# EasyEDA Pro project final.epro

# Schematic Schematic1
Board Name: Board1; Create Date: 2025-11-11; Page Name: P1; Project Name: New Project_2025-11-10_18-30-36; Schematic Name: Schematic1; Update Date: 2025-11-22; Company: EasyEDA.com; Page Size: A4; Version: V1.0
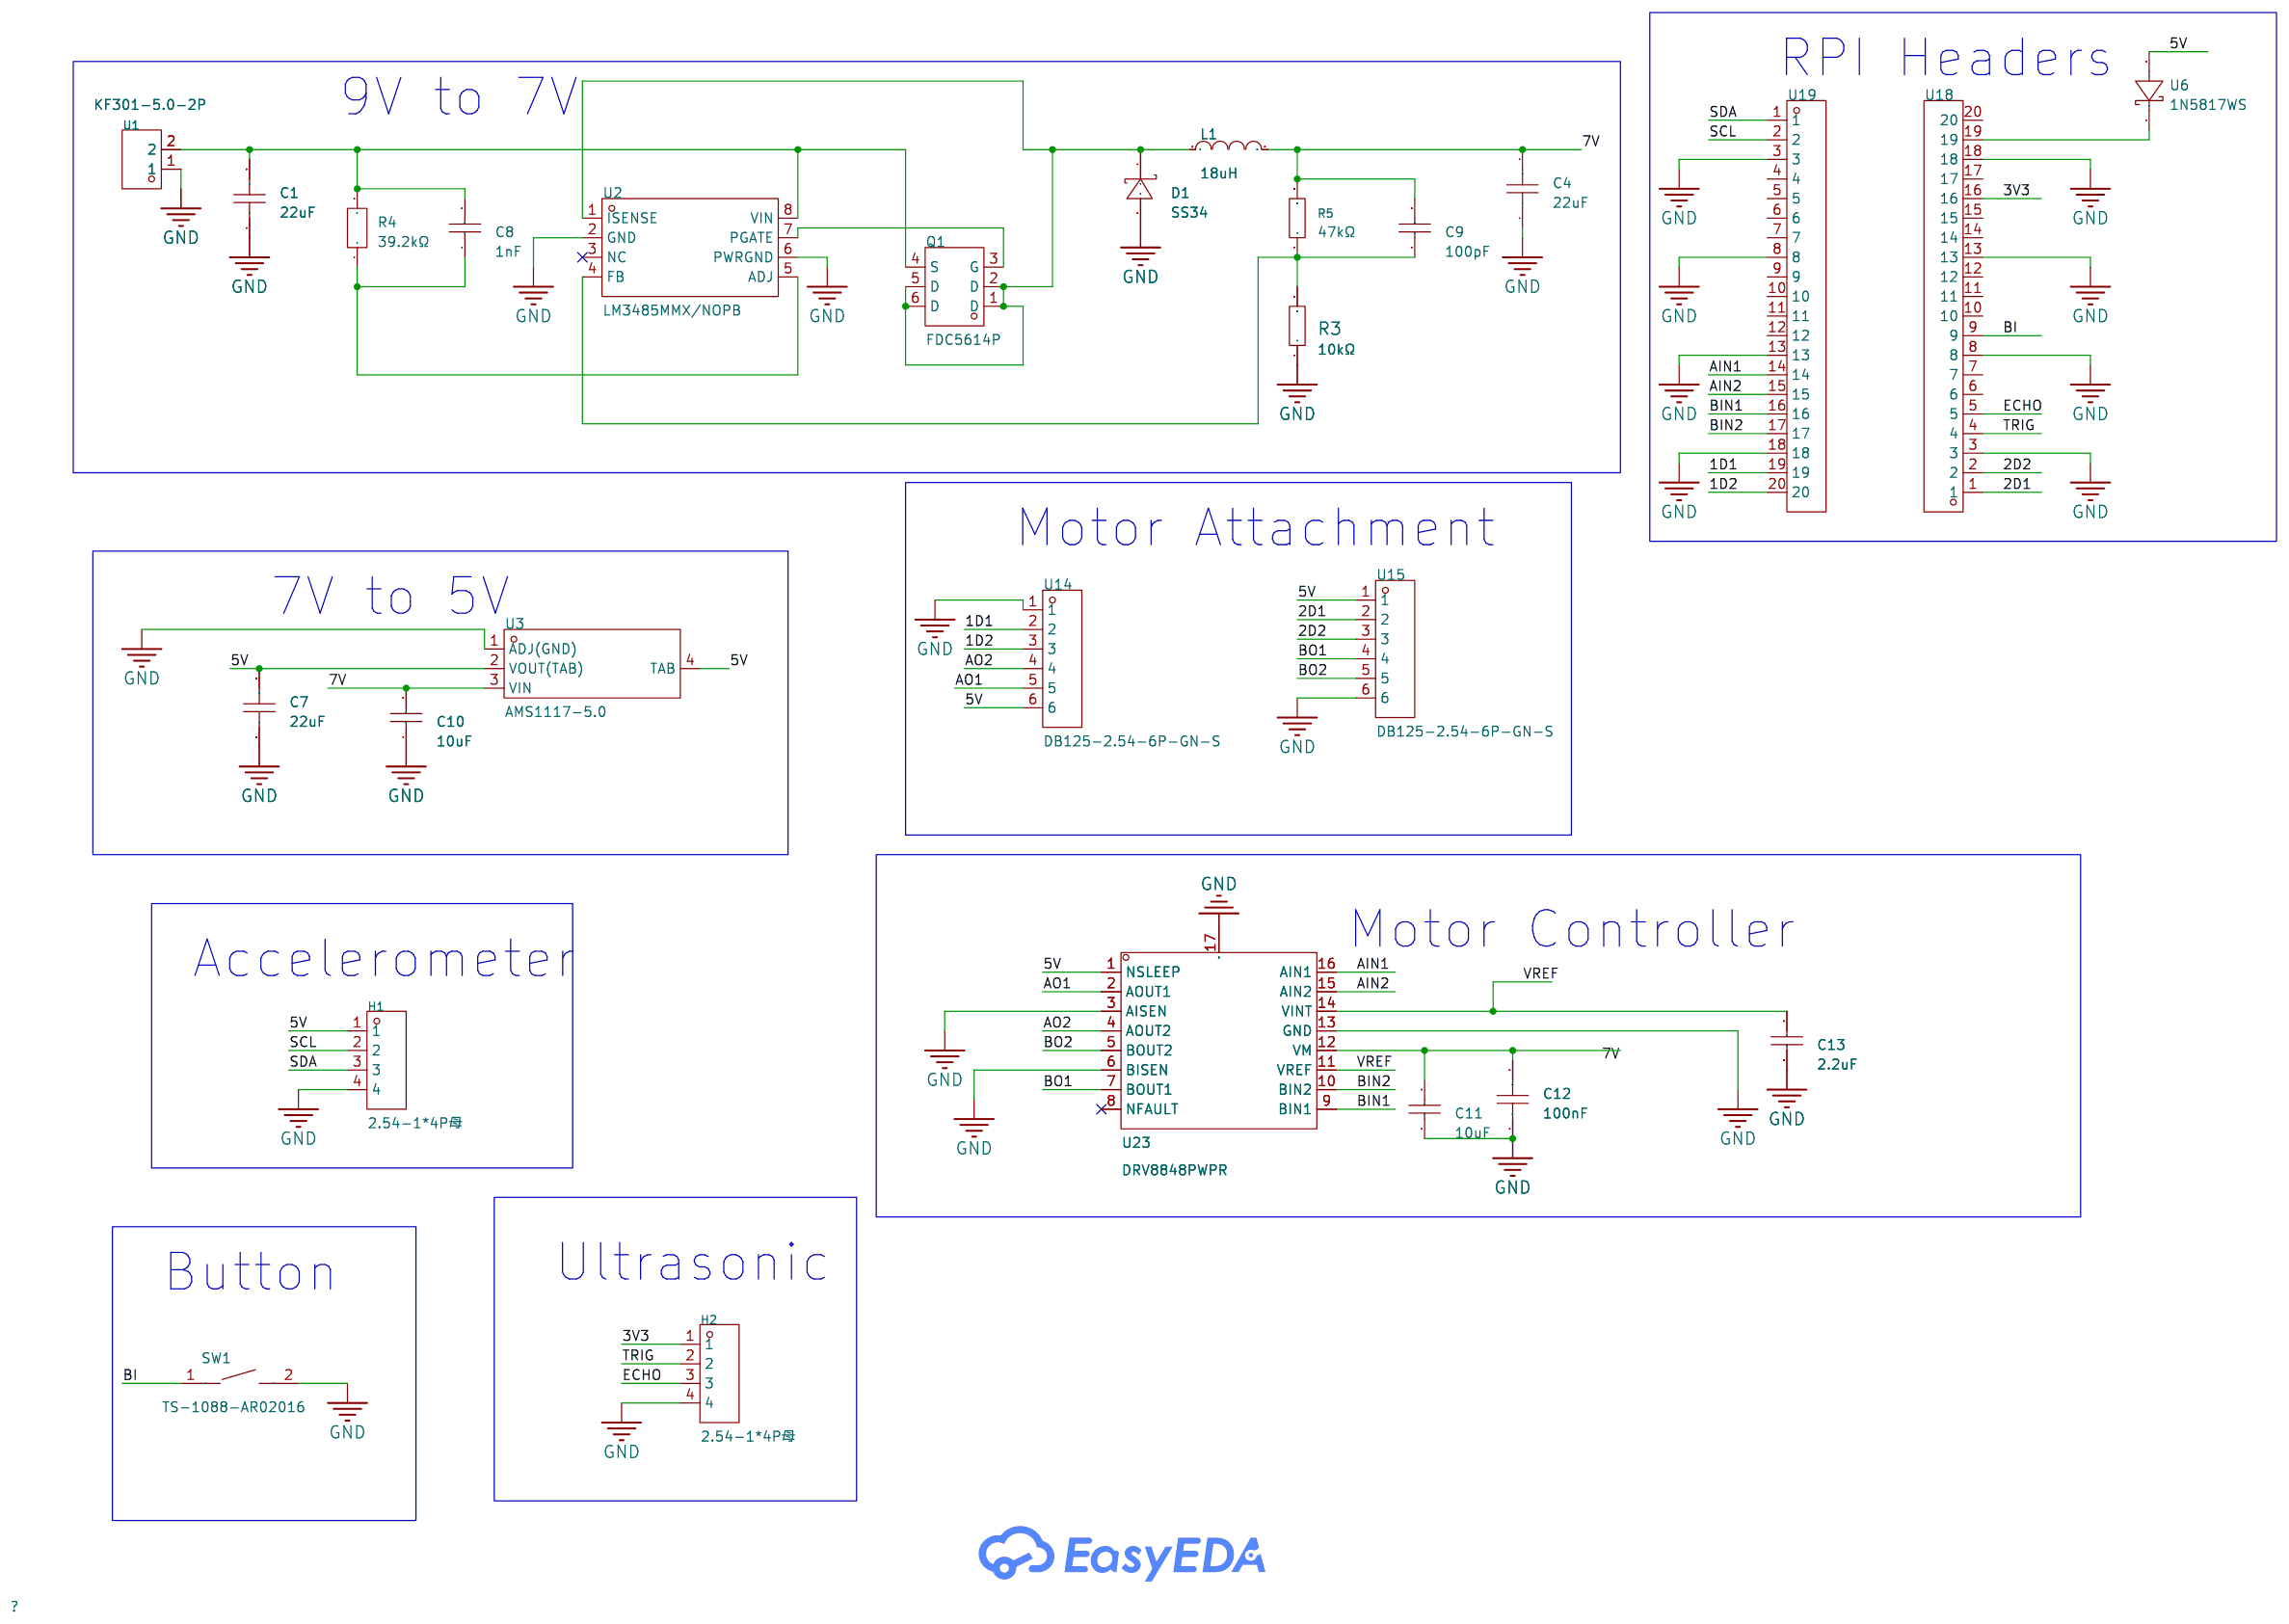
[diagram p0: schematic sheet]

## Parts
C1  22uF  [C0603]
C4  22uF  [C0603]
C7  22uF  [C0603]
C8  1nF  [C0402]
C9  100pF  [C0402]
C10  10uF  [C1206]
C11  10uF  [C1206]
C12  100nF  [C0402]
C13  2.2uF  [C0603]
D1  SS34  [SMA_L4.3-W2.6-LS5.2-RD]
H1  2.54-1*4P母  [HDR-TH_4P-P2.54-V-F]
H2  2.54-1*4P母  [HDR-TH_4P-P2.54-V-F]
L1  18uH  [IND-SMD_L4.0-W4.0_FNR4012S]
Q1  FDC5614P  [SOT-23-6_L2.9-W1.6-P0.95-LS2.8-BR]
R3  10kΩ  [R0603]
R4  39.2kΩ  [R0402]
R5  47kΩ  [R0805]
SW1  TS-1088-AR02016  [SW-SMD_L3.9-W3.0-P4.45]
U1  KF301-5.0-2P  [CONN-TH_P5.00_KF301-5.0-2P]
U2  LM3485MMX/NOPB  [VSSOP-8_L3.0-W3.0-P0.65-LS4.9-BL]
U3  AMS1117-5.0  [SOT-223_L6.7-W3.5-P2.30-BR]
U6  1N5817WS  [SOD-323_L1.7-W1.3-LS2.6-RD-1]
U14  DB125-2.54-6P-GN-S  [CONN-TH_DB125-2.54-6P-GN]
U15  DB125-2.54-6P-GN-S  [CONN-TH_DB125-2.54-6P-GN]
U18  ZX-PM2.54-1-20PY  [HDR-TH_20P-P2.54-V-F]
U19  ZX-PM2.54-1-20PY  [HDR-TH_20P-P2.54-V-F]
U23  DRV8848PWPR  [HTSSOP-16_L5.0-W4.4-P0.65-LS6.4-BL-EP]

## Library data of the parts
C1 C4 C7 = CL10A226MQ8NRNC: Capacitance:22uF Tolerance:±20% Tolerance:±20% Voltage Rating:6.3V Temperature Coefficient:X5R; LCSC Part Name: 22uF ±20% 6.3V; Supplier Part: C59461; Manufacturer: SAMSUNG(三星); Supplier Footprint: 0603; JLCPCB Part Class: Basic Part; Datasheet: https://item.szlcsc.com/datasheet/CL10A226MQ8NRNC/60514.html; Supplier: LCSC; Tolerance: ±20%; Voltage Rating: 6.3V; Temperature Coefficient: X5R
C8 = 0402B102K500NT: Capacitance:1nF Tolerance:±10% Tolerance:±10% Voltage Rating:50V Temperature Coefficient:X7R; LCSC Part Name: 1nF ±10% 50V; Supplier Part: C1523; Manufacturer: FH(风华); Supplier Footprint: 0402; JLCPCB Part Class: Basic Part; Datasheet: https://item.szlcsc.com/datasheet/0402B102K500NT/1875.html; Supplier: LCSC; Tolerance: ±10%; Voltage Rating: 50V; Temperature Coefficient: X7R
C9 = 0402CG101J500NT: Capacitance: Tolerance:±5% Tolerance:±5% Voltage Rated: Temperature Coefficient:; LCSC Part Name: 100pF ±5% 50V; Supplier Part: C1546; Manufacturer: FH(风华); Supplier Footprint: 0402; JLCPCB Part Class: Basic Part; Datasheet: https://atta.szlcsc.com/upload/public/pdf/source/20200305/C486355_26A10D38EF8C2A5C37091D0039909270.pdf; Supplier: LCSC; Tolerance: ±5%
C10 C11 = CL31A106KBHNNNE: Capacitance:10uF Tolerance:±10% Tolerance:±10% Voltage Rating:50V Temperature Coefficient:X5R; LCSC Part Name: 10uF ±10% 50V; Supplier Part: C13585; Manufacturer: SAMSUNG(三星); Supplier Footprint: 1206; JLCPCB Part Class: Basic Part; Datasheet: https://item.szlcsc.com/datasheet/CL31A106KBHNNNE/14236.html; Supplier: LCSC; Tolerance: ±10%; Voltage Rating: 50V; Temperature Coefficient: X5R
C12 = CL05B104KO5NNNC: Capacitance:100nF Tolerance:±10% Tolerance:±10% Voltage Rating:16V Temperature Coefficient:X7R; LCSC Part Name: 100nF ±10% 16V; Supplier Part: C1525; Manufacturer: SAMSUNG(三星); Supplier Footprint: 0402; JLCPCB Part Class: Basic Part; Datasheet: https://item.szlcsc.com/datasheet/CL05B104KO5NNNC/1877.html; Supplier: LCSC; Tolerance: ±10%; Voltage Rating: 16V; Temperature Coefficient: X7R
C13 = CL10A225KO8NNNC: Capacitance:2.2uF Tolerance:±10% Tolerance:±10% Voltage Rating:16V Temperature Coefficient:X5R; LCSC Part Name: 2.2uF ±10% 16V; Supplier Part: C23630; Manufacturer: SAMSUNG(三星); Supplier Footprint: 0603; JLCPCB Part Class: Basic Part; Datasheet: https://item.szlcsc.com/datasheet/CL10A225KO8NNNC/24366.html; Supplier: LCSC; Tolerance: ±10%; Voltage Rating: 16V; Temperature Coefficient: X5R
D1 = SS34_C8678: Diode Configuration:Independent Voltage - Forward(Vf@If):550mV@3A Voltage - DC Reverse(Vr):40V Current - Rectified:3A Reverse Leakage Current (Ir):500uA@40V Operating Junction Temperature Range:-55℃~+125℃ Operating Junction Temperature Range:-55℃~+125℃; LCSC Part Name: 电压:40V 电流:3A; Supplier Part: C8678; Manufacturer: MDD(辰达半导体); Supplier Footprint: SMA(DO-214AC); JLCPCB Part Class: Basic Part; Datasheet: https://item.szlcsc.com/datasheet/SS34/9178.html; Supplier: LCSC; Diode Configuration: Independent; Voltage - Forward(Vf@If): 550mV@3A; Voltage - DC Reverse(Vr): 40V; Current - Rectified: 3A; Reverse Leakage Current (Ir): 500uA@40V; Operating Junction Temperature Range: -55℃~+125℃
H1 H2 = 2.54-1*4P母: Holes Structure:1x4P Pitch:2.54mm Row Spacing:- Circular Hole / Square Hole:Square Hole Mounting Type:Through Hole Number of Rows:1 Number of Positions:4P Current Rating:3A Voltage Rating (Max):- Holes Direction:Top Insulation Height:- Contact Material:Br; LCSC Part Name: 间距:2.54mm 1x4P 直插; Supplier Part: C2718488; Manufacturer: BOOMELE(博穆精密); Supplier Footprint: 插件,P=2.54mm; JLCPCB Part Class: Extended Part; Datasheet: https://item.szlcsc.com/datasheet/2.54-1*4P%25E6%25AF%258D/2834502.html; Supplier: LCSC; Holes Structure: 1x4P; Pitch: 2.54mm; Circular Hole / Square Hole: Square Hole; Mounting Type: Through Hole; Number of Rows: 1; Number of Positions: 4P; Current Rating: 3A; Holes Direction: Top; Contact Material: Bronze; Operating Temperature: -40℃~+105℃
L1 = FNR4012S180MT: Inductance:18uH Tolerance:±20% Tolerance:±20% Current Rating:800mA Current - Saturation(Isat):750mA DC Resistance(DCR):611mΩ Type:Magnetic Shielded Inductor; LCSC Part Name: 18uH ±20% 750mA; Supplier Part: C167788; Manufacturer: cjiang(长江微电); Supplier Footprint: SMD,4x4mm; JLCPCB Part Class: Extended Part; Datasheet: https://item.szlcsc.com/datasheet/FNR4012S180MT/179171.html; Supplier: LCSC; Tolerance: ±20%; Current Rating: 800mA; Current - Saturation(Isat): 750mA; DC Resistance(DCR): 611mΩ; Type: Magnetic Shielded Inductor
Q1 = FDC5614P_C3029022: Number:1 P-Channel Drain to Source Voltage:60V Current - Continuous Drain(Id):3.3A RDS(on):80mΩ@10V Pd - Power Dissipation:2W Gate Threshold Voltage (Vgs(th)):1.6V@250uA Gate Charge(Qg):10nC@10V Input Capacitance(Ciss):720pF Reverse Transfer Capacitance (; LCSC Part Name: FDC5614P丝印564 1个P沟道 耐压:60V 电流:3.3A; Supplier Part: C3029022; Manufacturer: MSKSEMI(美森科); Supplier Footprint: SOT-23-6; JLCPCB Part Class: Extended Part; Datasheet: https://item.szlcsc.com/datasheet/FDC5614P/3559745.html; Supplier: LCSC; Number: 1 P-Channel; Drain to Source Voltage: 60V; Current - Continuous Drain(Id): 3.3A; RDS(on): 80mΩ@10V; Pd - Power Dissipation: 2W; Gate Threshold Voltage (Vgs(th)): 1.6V@250uA; Gate Charge(Qg): 10nC@10V; Input Capacitance(Ciss): 720pF; Reverse Transfer Capacitance (Crss@Vds): 32pF; Operating Temperature: -55℃~+125℃; Output Capacitance(Coss): 42pF
R3 = 0603WAF1002T5E: Type:Thick Film Resistor Resistance:10kΩ Tolerance:±1% Tolerance:±1% Power(Watts):100mW Voltage-Supply(Max):75V Temperature Coefficient:±100ppm/℃ Temperature Coefficient:±100ppm/℃ Operating Temperature:-55℃~+155℃ Operating Temperature:-55℃~+155℃; LCSC Part Name: 厚膜电阻 10kΩ ±1% 100mW; Supplier Part: C25804; Manufacturer: UNI-ROYAL(厚声); Supplier Footprint: 0603; JLCPCB Part Class: Basic Part; Datasheet: https://item.szlcsc.com/datasheet/0603WAF1002T5E/26547.html; Supplier: LCSC; Type: Thick Film Resistor; Tolerance: ±1%; Power(Watts): 100mW; Voltage-Supply(Max): 75V; Temperature Coefficient: ±100ppm/℃; Operating Temperature: -55℃~+155℃
R4 = FRC0402F3922TS: Type:Thick Film Resistor Resistance:39.2kΩ Tolerance:±1% Tolerance:±1% Power(Watts):62.5mW Voltage-Supply(Max):50V Temperature Coefficient:±100ppm/℃ Temperature Coefficient:±100ppm/℃ Operating Temperature:-55℃~+155℃ Operating Temperature:-55℃~+155℃; LCSC Part Name: 厚膜电阻 39.2kΩ ±1% 62.5mW; Supplier Part: C7467415; Manufacturer: FOJAN(富捷); Supplier Footprint: 0402; JLCPCB Part Class: Extended Part; Datasheet: https://item.szlcsc.com/datasheet/FRC0402F3922TS/8514031.html; Supplier: LCSC; Type: Thick Film Resistor; Tolerance: ±1%; Power(Watts): 62.5mW; Voltage-Supply(Max): 50V; Temperature Coefficient: ±100ppm/℃; Operating Temperature: -55℃~+155℃
R5 = 0805W8F4702T5E: Type:Thick Film Resistor Resistance:47kΩ Tolerance:±1% Tolerance:±1% Power(Watts):125mW Voltage-Supply(Max):150V Temperature Coefficient:±100ppm/℃ Temperature Coefficient:±100ppm/℃ Operating Temperature:-55℃~+155℃ Operating Temperature:-55℃~+155℃; LCSC Part Name: 47kΩ ±1% 125mW 厚膜电阻; Supplier Part: C17713; Manufacturer: UNI-ROYAL(厚声); Supplier Footprint: 0805; JLCPCB Part Class: Basic Part; Datasheet: https://item.szlcsc.com/datasheet/0805W8F4702T5E/18401.html; Supplier: LCSC; Type: Thick Film Resistor; Tolerance: ±1%; Power(Watts): 125mW; Voltage-Supply(Max): 150V; Temperature Coefficient: ±100ppm/℃; Operating Temperature: -55℃~+155℃
SW1 = TS-1088-AR02016: Circuit:SPST Actuator Style:Round Button Operating Force:1.6N Mounting Type:Surface Mount,Vertical Length:4mm Width:3mm Switch Height:2mm with Bracket:Without Bracket Contact Current:50mA Voltage Rating:12V Actuator/Cap Color:Black Termination Style:SMD(S; LCSC Part Name: 4*3*2mm 立贴 轻触开关; Supplier Part: C720477; Manufacturer: XUNPU(讯普); Supplier Footprint: SMD,4x3mm; JLCPCB Part Class: Basic Part; Datasheet: https://item.szlcsc.com/datasheet/TS-1088-AR02016/763484.html; Supplier: LCSC; Circuit: SPST; Actuator Style: Round Button; Operating Force: 1.6N; Mounting Type: Surface Mount,Vertical; Length: 4mm; Width: 3mm; Switch Height: 2mm; with Bracket: Without Bracket; Contact Current: 50mA; Voltage Rating: 12V; Actuator/Cap Color: Black; Termination Style: SMD(SMT) Tab; Life: 100,000 Cycles; Operating Temperature: -30℃~+80℃
U1 = KF301-5.0-2P: Structure:1x2P Pitch:5mm Color:Blue Mounting Style:Straight Current Rating (Max):17A Voltage Rating (Max):250V Number of Pins:2P Number of Rows:1 Wire Gauge - AWG:14~22 Wire Gauge - AWG:14~22 Wire Gauge - mm2:1.5 Wire Gauge - mm2:1.5 Number of PINs Per Ro; LCSC Part Name: 5mm 1x2P 排数:1 每排P数:2 直插; Supplier Part: C474881; Manufacturer: KEFA(科发); Supplier Footprint: 插件,P=5mm; JLCPCB Part Class: Extended Part; Datasheet: https://atta.szlcsc.com/upload/public/pdf/source/20230317/03A5B5FC229D6F9225E8F51DA1A4E80A.pdf; Supplier: LCSC; Structure: 1x2P; Pitch: 5mm; Color: Blue; Mounting Style: Straight; Current Rating (Max): 17A; Voltage Rating (Max): 250V; Number of Pins: 2P; Number of Rows: 1; Wire Gauge - AWG: 14~22; Wire Gauge - mm2: 1.5; Number of PINs Per Row: 2; Operating Temperature Range: -30℃~+120℃
U2 = LM3485MMX/NOPB: Function:Buck Voltage - Supply:4.5V~35V Voltage - Supply:4.5V~35V Output Voltage:1.242V~35V Output Voltage:1.242V~35V Output Current:- Frequency - Switching:1MHz Frequency - Switching:1MHz Operating Temperature:-40℃~+125℃@(TJ) Operating Temperature:-40℃~+; LCSC Part Name: LM3485 集成迟滞PFET降压控制器; Supplier Part: C882395; Manufacturer: TI(德州仪器); Supplier Footprint: VSSOP-8-0.65mm; JLCPCB Part Class: Extended Part; Datasheet: https://www.ti.com/cn/lit/gpn/lm3485-q1; Supplier: LCSC; Function: Buck; Voltage - Supply: 4.5V~35V; Output Voltage: 1.242V~35V; Frequency - Switching: 1MHz; Operating Temperature: -40℃~+125℃@(TJ); Synchronous Rectifier: No; Number of Outputs: 1; Topology: Buck; Quiescent Current: 250uA; Switch tube (built-in/external): External; Output Type: Adjustable
U3 = AMS1117-5.0_C347223: Output Type:Fixed Maximum Input Voltage:18V Output Voltage:5V Output Voltage:5V Output Current:1A Power Supply Rejection Ratio (PSRR):60dB@(120Hz) Dropout Voltage:1.3V@(1A) standby current:- Noise:- Feature:Overcurrent Protection(OCP) Operating Temperatur; LCSC Part Name: 输出:5V 电流:1A 耐压:12V; Supplier Part: C347223; Manufacturer: UMW(友台半导体); Supplier Footprint: SOT-223; JLCPCB Part Class: Extended Part; Datasheet: https://atta.szlcsc.com/upload/public/pdf/source/20241218/BAF0263FA2E44BCD8AF41AA4FA04EFAA.pdf; Supplier: LCSC; Output Type: Fixed; Maximum Input Voltage: 18V; Output Voltage: 5V; Output Current: 1A; Power Supply Rejection Ratio (PSRR): 60dB@(120Hz); Dropout Voltage: 1.3V@(1A); Feature: Overcurrent Protection(OCP); Output Polarity: Positive electrode; Number of Outputs: 1
U6 = 1N5817WS_C5190152: Reverse Voltage (Vr):20V Rectified Current:1A; LCSC Part Name: 电压:20V 电流:1A; Supplier Part: C5190152; Manufacturer: Hottech(合科泰); Supplier Footprint: SOD-323; JLCPCB Part Class: Extended Part; Datasheet: https://atta.szlcsc.com/upload/public/pdf/source/20221011/0135DD526E6E216218CEB88C6A2F208C.pdf; Supplier: LCSC; Reverse Voltage (Vr): 20V; Rectified Current: 1A
U14 U15 = DB125-2.54-6P-GN-S: Number of Positions or Pins:1x6P Pitch:2.54mm Color:Green Mounting Type:Through Hole Number of Pins:6P Number of Rows:1 Number of PINs Per Row:6 Current Rating:7A Voltage Rating (Max):150V Wire Gauge - AWG:18~26 Wire Gauge - AWG:18~26 Wire Gauge - mm2:1 W; LCSC Part Name: 1x6P 2.54mm 直插 排数:1 每排P数:6; Supplier Part: C918124; Manufacturer: DORABO(地博电气); Supplier Footprint: 插件,P=2.54mm; JLCPCB Part Class: Extended Part; Datasheet: https://item.szlcsc.com/datasheet/DB125-2.54-6P-GN-S/993703.html; Supplier: LCSC; Number of Positions or Pins: 1x6P; Pitch: 2.54mm; Color: Green; Mounting Type: Through Hole; Number of Pins: 6P; Number of Rows: 1; Number of PINs Per Row: 6; Current Rating: 7A; Voltage Rating (Max): 150V; Wire Gauge - AWG: 18~26; Wire Gauge - mm2: 1; Operating Temperature: -40℃~+105℃
U18 U19 = ZX-PM2.54-1-20PY: Holes Structure:1x20P Pitch:2.54mm Row Spacing:- Circular Hole / Square Hole:Square Hole Mounting Type:Through Hole Number of Rows:1 Number of Positions:20P Current Rating:3A Voltage Rating (Max):- Holes Direction:Top Insulation Height:8.5mm Contact Mater; LCSC Part Name: 1x20P 间距:2.54mm 直插; Supplier Part: C7499336; Manufacturer: Megastar(兆星); Supplier Footprint: 插件,P=2.54mm; JLCPCB Part Class: Extended Part; Datasheet: https://item.szlcsc.com/datasheet/ZX-PM2.54-1-20PY/8573997.html; Supplier: LCSC; Holes Structure: 1x20P; Pitch: 2.54mm; Circular Hole / Square Hole: Square Hole; Mounting Type: Through Hole; Number of Rows: 1; Number of Positions: 20P; Current Rating: 3A; Holes Direction: Top; Insulation Height: 8.5mm; Contact Plating: Gold; Operating Temperature: -40℃~+105℃; PIN Length: 3.2mm
U23 = DRV8848PWPR: LCSC Part Name: 4A 有刷直流电机驱动芯片 18V; Supplier Part: C131079; Manufacturer: TI(德州仪器); Supplier Footprint: HTSSOP-16-EP; JLCPCB Part Class: Extended Part; Datasheet: https://www.ti.com/cn/lit/gpn/drv8848; Supplier: LCSC

## Nets
3V3: H2.1 U18.16
5V: C7.2 H1.1 U3.2(VOUT(TAB)) U3.4(TAB) U6.2(A) U14.6 U15.1 U23.1(NSLEEP)
7V: C4.2 C9.2 C10.2 C11.2 C12.2 L1.2 R5.2 U3.3(VIN) U23.12(VM)
GND: C1.1 C4.1 C7.1 C10.1 C11.1 C12.1 C13.1 D1.2(A) H1.4 H2.4 R3.1 SW1.2 U1.1 U2.2(GND) U2.6(PWRGND) U3.1(ADJ(GND)) U14.1 U15.6 U18.3 U18.8 U18.13 U18.18 U19.3 U19.8 U19.13 U19.18 U23.3(AISEN) U23.6(BISEN) U23.13(GND) U23.17(PAD)
1D1: U14.2 U19.19
1D2: U14.3 U19.20
2D1: U15.2 U18.1
2D2: U15.3 U18.2
AIN1: U19.14 U23.16(AIN1)
AIN2: U19.15 U23.15(AIN2)
AO1: U14.5 U23.2(AOUT1)
AO2: U14.4 U23.4(AOUT2)
BI: SW1.1 U18.9
BIN1: U19.16 U23.9(BIN1)
BIN2: U19.17 U23.10(BIN2)
BO1: U15.4 U23.7(BOUT1)
BO2: U15.5 U23.5(BOUT2)
ECHO: H2.3 U18.5
SCL: H1.2 U19.2
SDA: H1.3 U19.1
TRIG: H2.2 U18.4
VREF: C13.2 U23.11(VREF) U23.14(VINT)
$1N633: D1.1(K) L1.1 Q1.1(D) Q1.2(D) Q1.5(D) Q1.6(D) U2.1(ISENSE)
$1N828: C8.1 R4.1 U2.5(ADJ)
$1N1411: C9.1 R3.2 R5.1 U2.4(FB)
$1N2115: C1.2 C8.2 Q1.4(S) R4.2 U1.2 U2.8(VIN)
$1N2335: Q1.3(G) U2.7(PGATE)
$1N3468: U6.1(C) U18.19

Not connected (* = marked no-connect by the designer): U2 3(NC)*; U18 6 7 10 11 12 14 15 17 20; U19 4 5 6 7 9 10 11 12; U23 8(NFAULT)*

## Notes on the sheet
- RPI Headers
- 9V to 7V
- Motor Attachment
- 7V to 5V
- Motor Controller
- Accelerometer
- Button
- Ultrasonic

# Board PCB1
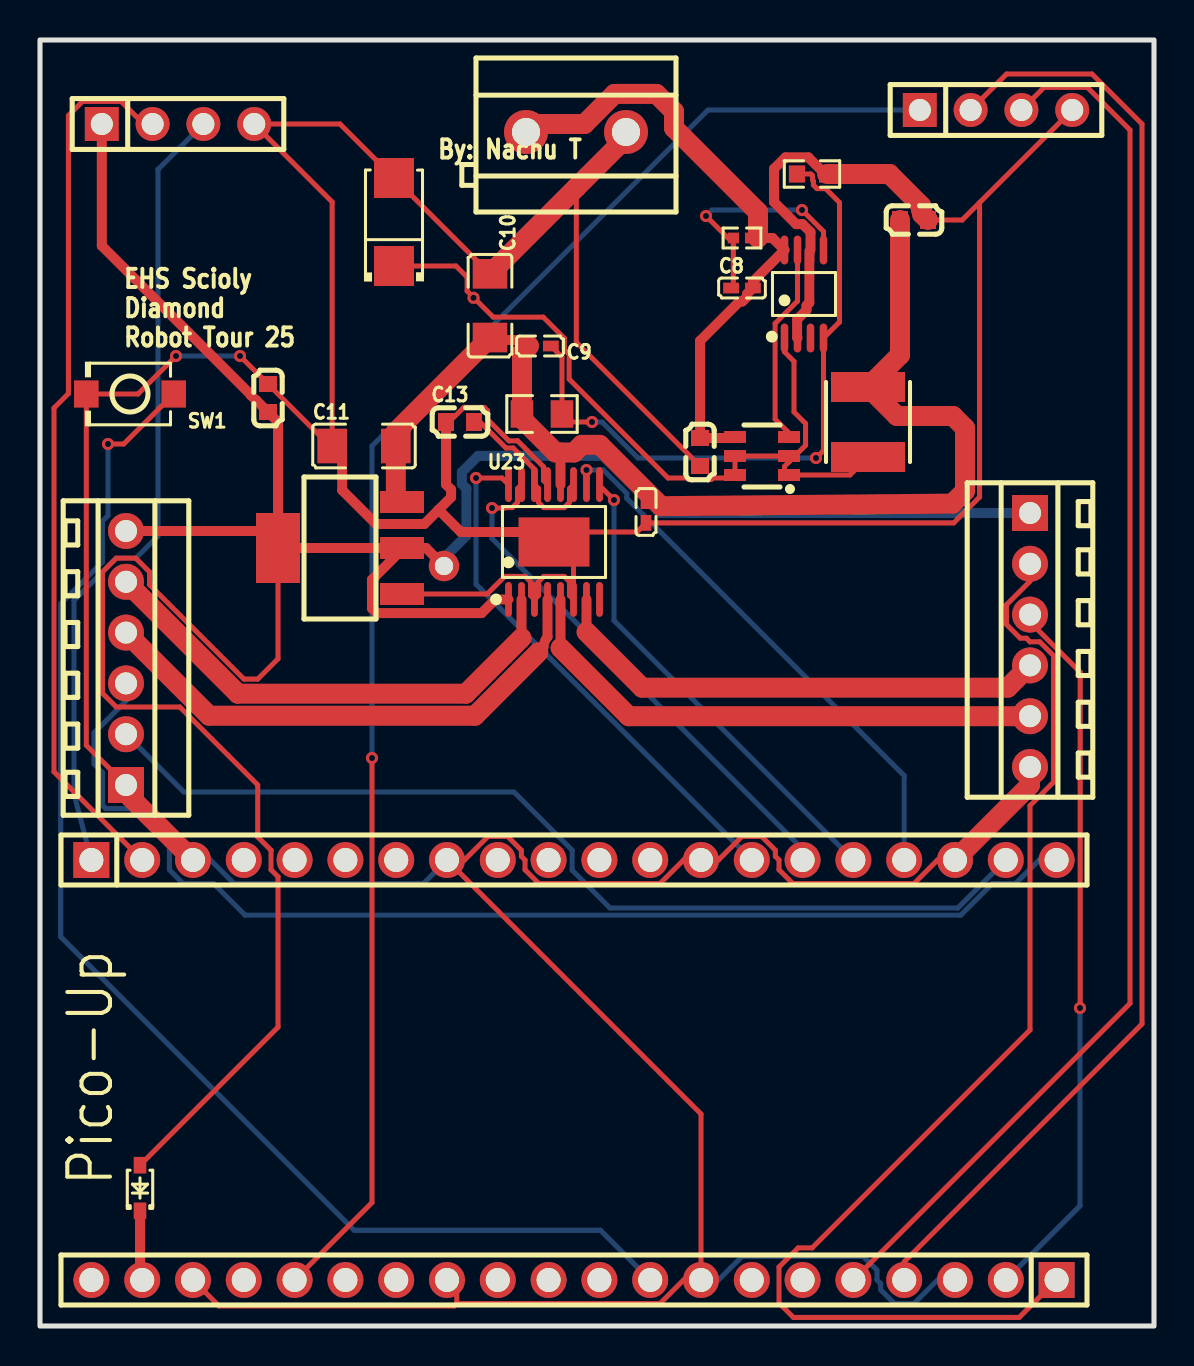
[diagram p1: board, top side]
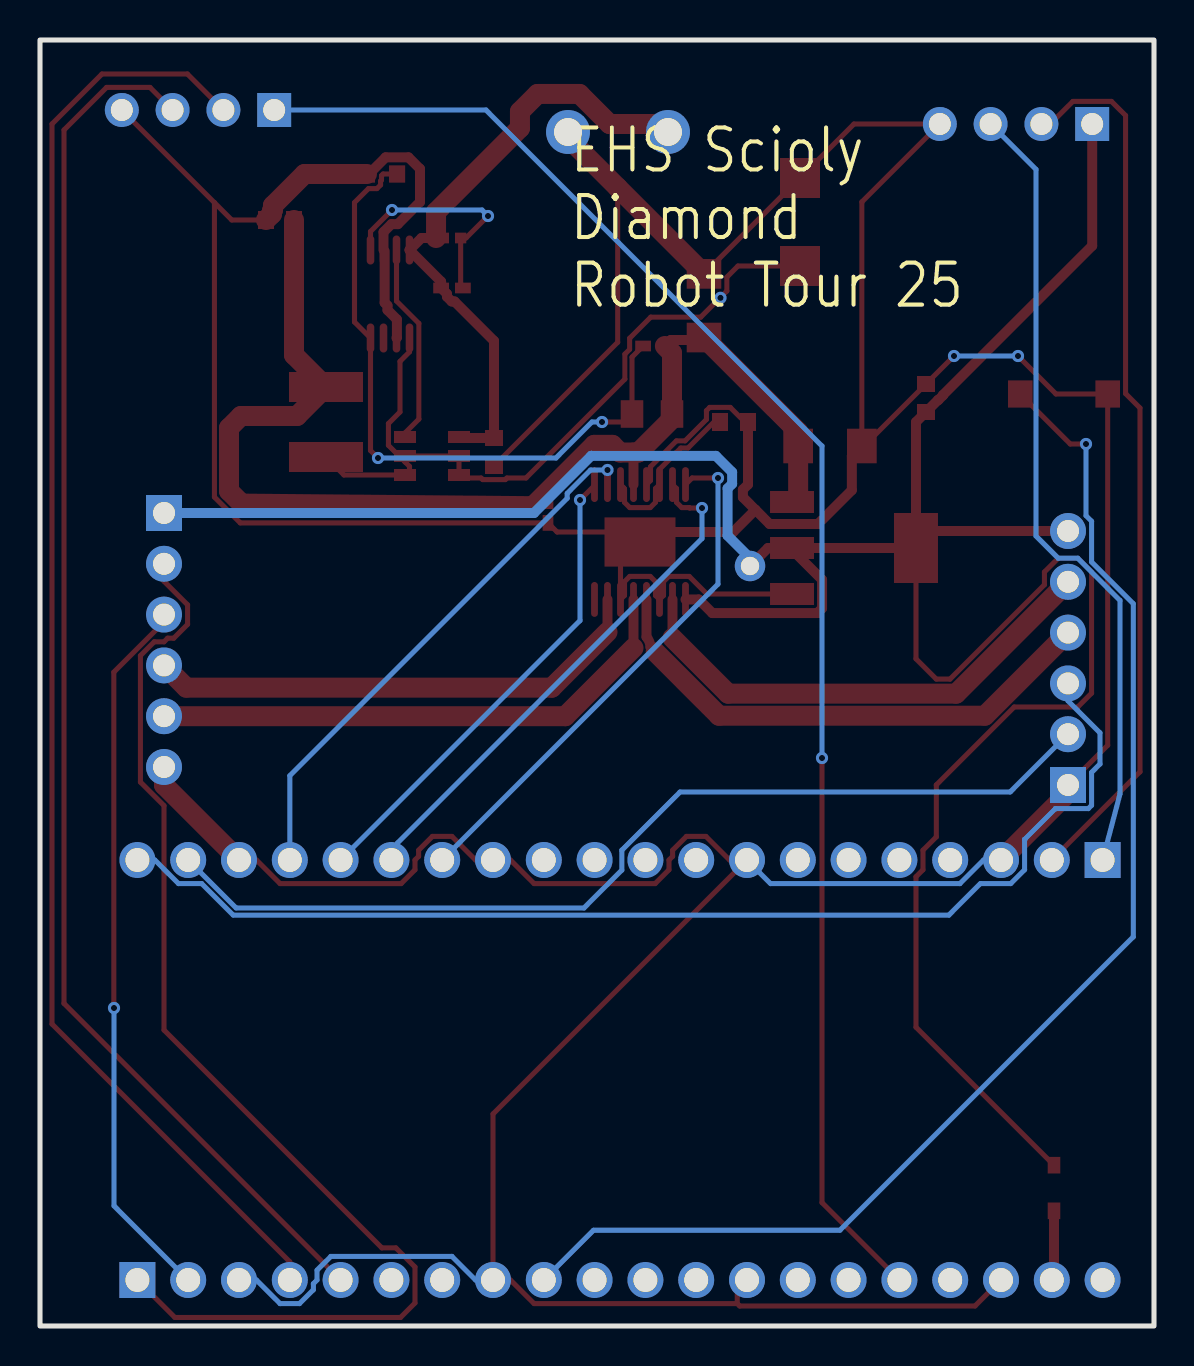
[diagram p2: board, bottom side, seen from below]

Outline 55.7 x 64.3 mm; copper layers: Top Layer, Bottom Layer. Coordinates in mm from the lower left corner of the outline.
Outline path: rectangle 0,64.3 55.7,0
Stack: Top Layer 0.035mm / Dielectric1 1.51mm FR4 er 4.5 / Bottom Layer 0.035mm

## Design rules (mm)
template: JLCPCB Capability(Two Layers Board)
spacing copperThickness1oz (default): track to track 0.102, other pairs 0.152 to 0.3
spacing copperThickness2oz: track to track 0.203, other pairs 0.152 to 0.3
track width copperThickness1oz (default): min 0.127, default 0.254, max 2.54
track width copperThickness2oz: min 0.203, default 0.254, max 2.54
differential pair differentialPair (default): width min 0.127, default 0.254, max 2.54; gap min 0.152, default 0.152
via viaSize (default): diameter min 0.5, default 0.61, max 10; hole min 0.3, default 0.305, max 6.3

## Placement (name value [footprint] x y rotation side)
C1  22uF  [C0603]  33 43.7 90 top
C4  22uF  [C0603]  43.7 55.3 180 top
C7  22uF  [C0603]  11.4 46.4 270 top
C8  1nF  [C0402]  35.1 51.9 0 top
C9  100pF  [C0402]  25 49 180 top
C10  10uF  [C1206]  22.5 51.02 270 top
C11  10uF  [C1206]  16.2 44 0 top
C12  100nF  [C0402]  30.3 40.7 90 top
C13  2.2uF  [C0603]  21 45.2 0 top
D1  SS34  [SMA_L4.3-W2.6-LS5.2-RD]  17.7 55.2 90 top
H1  2.54-1*4P母  [HDR-TH_4P-P2.54-V-F]  6.9 60.1 0 top
H2  2.54-1*4P母  [HDR-TH_4P-P2.54-V-F]  47.8 60.8 0 top
L1  18uH  [IND-SMD_L4.0-W4.0_FNR4012S]  41.4 45.2 90 top
NOREF  -  [Pad_e2166]  20.2 38 0 top
Q1  FDC5614P  [SOT-23-6_L2.9-W1.6-P0.95-LS2.8-BR]  36.1 43.5 0 top
R3  10kΩ  [R0603]  38.6 57.6 180 top
R4  39.2kΩ  [R0402]  35.1 54.4 0 top
R5  47kΩ  [R0805]  25.1 45.6 180 top
SW1  TS-1088-AR02016  [SW-SMD_L3.9-W3.0-P4.45]  4.5 46.6 180 top
U1  KF301-5.0-2P  [CONN-TH_P5.00_KF301-5.0-2P]  26.8 59.7 180 top
U2  LM3485MMX/NOPB  [VSSOP-8_L3.0-W3.0-P0.65-LS4.9-BL]  38.2 51.6 0 top
U3  AMS1117-5.0  [SOT-223_L6.7-W3.5-P2.30-BR]  15 38.9 0 top
U6  1N5817WS  [SOD-323_L1.7-W1.3-LS2.6-RD-1]  5 6.9 90 top
U14  DB125-2.54-6P-GN-S  [CONN-TH_DB125-2.54-6P-GN]  4.3 33.4 90 top
U15  DB125-2.54-6P-GN-S  [CONN-TH_DB125-2.54-6P-GN]  49.5 34.3 270 top
U18  ZX-PM2.54-1-20PY  [HDR-TH_20P-P2.54-V-F]  26.7 2.3 180 top
U19  ZX-PM2.54-1-20PY  [HDR-TH_20P-P2.54-V-F]  26.7 23.3 0 top
U23  DRV8848PWPR  [HTSSOP-16_L5.0-W4.4-P0.65-LS6.4-BL-EP]  25.7 39.2 0 top

## Footprints (pads in the part's own frame, mm; a bottom-side part is the same pattern mirrored in y, then rotated)
C0402
  rect 0.79x0.54 smd: 1(-0.545,0) 2(0.545,0)
C0603
  rect 0.8x0.9 smd: 1(-0.7,0) 2(0.7,0)
C1206
  rect 1.485x1.728 smd: 1(-1.593,0) 2(1.593,0)
CONN-TH_DB125-2.54-6P-GN
  rect 1.8x1.8 hole 1.1: 1(-6.35,0)
  round 1.8 hole 1.1: 2(-3.81,0) 3(-1.27,0) 4(1.27,0) 5(3.81,0) 6(6.35,0)
CONN-TH_P5.00_KF301-5.0-2P
  round 2.2 hole 1.4: 1(-2.5,0) 2(2.5,0)
HDR-TH_4P-P2.54-V-F
  rect 1.7x1.7 hole 1.1: 1(-3.81,0)
  round 1.7 hole 1.1: 2(-1.27,0) 3(1.27,0) 4(3.81,0)
HDR-TH_20P-P2.54-V-F
  rect 1.8x1.8 hole 1.2: 1(-24.13,0)
  round 1.8 hole 1.2: 2(-21.59,0) 3(-19.05,0) 4(-16.51,0) 5(-13.97,0) 6(-11.43,0) 7(-8.89,0) 8(-6.35,0) 9(-3.81,0) 10(-1.27,0) 11(1.27,0) 12(3.81,0) 13(6.35,0) 14(8.89,0) 15(11.43,0) 16(13.97,0) 17(16.51,0) 18(19.05,0) 19(21.59,0) 20(24.13,0)
HTSSOP-16_L5.0-W4.4-P0.65-LS6.4-BL-EP
  oval 0.343x1.746 smd: 1(-2.275,-2.873) 2(-1.625,-2.873) 3(-0.975,-2.873) 4(-0.325,-2.873) 5(0.325,-2.873) 6(0.975,-2.873) 7(1.625,-2.873) 8(2.275,-2.873) 9(2.275,2.873) 10(1.625,2.873) 11(0.975,2.873) 12(0.325,2.873) 13(-0.325,2.873) 14(-0.975,2.873) 15(-1.625,2.873) 16(-2.275,2.873)
  rect 3.55x2.46 smd: 17(0,0)
IND-SMD_L4.0-W4.0_FNR4012S
  rect 1.5x3.7 smd: 1(-1.75,0) 2(1.75,0)
Pad_e2166
  round 1.524 hole 0.914: 1(0,0)
R0402
  rect 0.566x0.54 smd: 1(-0.433,0) 2(0.433,0)
R0603
  rect 0.806x0.864 smd: 1(-0.753,0) 2(0.753,0)
R0805
  rect 1.133x1.377 smd: 1(-1,0) 2(1,0)
SMA_L4.3-W2.6-LS5.2-RD
  rect 2x2 smd: 1(-2.2,0) 2(2.2,0)
SOD-323_L1.7-W1.3-LS2.6-RD-1
  rect 0.83x0.63 smd: 1(-1.14,0) 2(1.14,0)
SOT-23-6_L2.9-W1.6-P0.95-LS2.8-BR
  rect 1.1x0.6 smd: 1(1.35,-0.95) 2(1.35,0) 3(1.35,0.95) 4(-1.35,0.95) 5(-1.35,0) 6(-1.35,-0.95)
SOT-223_L6.7-W3.5-P2.30-BR
  rect 2.2x1.1 smd: 1(3.099,-2.3) 2(3.099,0) 3(3.099,2.3)
  rect 2.2x3.5 smd: 4(-3.099,0)
SW-SMD_L3.9-W3.0-P4.45
  rect 1.23x1.36 smd: 1(-2.185,0) 2(2.185,0)
VSSOP-8_L3.0-W3.0-P0.65-LS4.9-BL
  oval 0.38x1.45 smd: 1(-0.975,-2.2) 2(-0.325,-2.2) 3(0.325,-2.2) 4(0.975,-2.2) 5(0.975,2.2) 6(0.325,2.2) 7(-0.325,2.2) 8(-0.975,2.2)

## Nets
As in the schematic, except:
5V: C7.2 H1.1 NOREF.1 U3.2 U3.4 U6.2 U14.6 U15.1 U23.1

Pads without a net: U2 3; U18 6 7 10 11 12 14 15 17 20; U19 4 5 6 7 9 10 11 12; U23 8

## Via types
v1: diameter 0.61, hole 0.305, Top Layer to Bottom Layer, 14 vias

## Routing (per net, layer and track width the routed paths; a pad name or vN(x,y) marks a point on that pad's centre or on a via; arc(x,y) is an arc through that point)
3V3: length 77.7
  Top Layer w0.254: U18.16 16.6,6.17 v1(16.6,28.4)
  Bottom Layer w0.254: H2.1 33.4,60.8 16.6,44 v1(16.6,28.4)
5V: length 143.4
  Top Layer w0.254: U6.2 11.9,14.94 11.9,22.46 11.55,22.81 11.55,23.79 10.89,24.45 10.89,27.05 6.99,30.95 3.81,30.95 3.12,31.64 3.12,37.7 3.81,38.39 4.79,38.39 5.48,37.7 5.48,37.06 10.2,32.34 10.89,32.34 11.9,33.36 11.9,38.9
  Top Layer w0.5: NOREF.1 19.3,38.9 U3.2 ; 11.9,38.9 11.05,39.75 U14.6 ; 11.9,38.9 U3.2 ; 11.9,38.9 11.9,45.2 C7.2 10.8,46.3 10.78,46.3 10.55,46.53 10.55,46.55 3.09,54.01 H1.1 ; 23.42,36.33 22.76,36.33 22.08,35.65 16.83,35.65 16.6,35.88 16.6,37.32 18.1,38.82 U3.2
  Bottom Layer w0.5: NOREF.1 20.2,38.4 21.32,39.52 21.32,41.88 21.09,42.11 21.09,42.69 21.91,43.51 28.14,43.51 31,40.65 U15.1
7V: length 60.3
  Top Layer w0.5: 22.39,49.3 24.16,49.3 C9.2 ; 26.02,43.67 26.02,42.07
  Top Layer w1: U3.3 17.79,41.51 C11.2 17.79,44.72 C10.2 ; C9.2 24.1,48.64 R5.2 24.1,45.35 25.78,43.67 26.7,43.67 27.08,44.06 27.98,44.06 31.05,40.99 45.62,41.12 46.25,41.75 46.25,44.9 45.65,45.5 42.85,45.5 L1.2 43,48.55 C4.2
GND: length 325
  Top Layer w0.254: U18.13 20.84,1.81 20.84,1.12 ; 25.38,42.07 25.18,42.27 25.18,42.96 23.88,44.26 23.45,44.26 22.38,45.32 22.38,45.77 22.22,45.93 21.18,45.93 20.46,45.2 C13.1 ; 46.98,56.17 46.11,55.3 C4.1 ; 46.98,56.17 H2.4 ; 46.98,56.17 46.98,41.45 45.69,40.16 C12.1 29.85,39.7 25.2,39.7 ; C1.1 26.82,49.18 26.82,56.92 ; v1(10,48.5) C7.1 14.5,44 C11.1 14.61,56.2 H1.4 15,60.1 D1.2 17.71,57.4 C10.1 ; v1(6.8,48.5) 4.9,46.6 SW1.2 2.31,29.03 U14.1 ; U3.1 22.36,36.6 23.24,37.48 24.26,37.48 24.53,37.22 24.53,36.53 24.73,36.33 24.92,36.53 24.92,37.22 25.19,37.48 26.21,37.48 26.48,37.22 26.48,36.53 26.67,36.33 26.67,38.22 26.2,38.7 ; U19.18 44.88,23.3 43.7,22.12 37.64,22.12 36.95,22.81 36.95,23.3 36.77,23.48 36.77,23.79 36.08,24.48 35.1,24.48 33.92,23.3 U19.13 32.18,23.3 31,22.12 24.94,22.12 24.25,22.81 24.25,23.3 24.07,23.48 24.07,23.79 23.38,24.48 22.4,24.48 21.22,23.3 U19.8 33.05,10.6 U18.8 32.18,2.3 31,1.12 20.84,1.12 ; 20.84,1.12 20.72,1 8.95,1 U18.18 ; 29.3,59.41 U1.1
  Top Layer w0.5: 19.93,40.81 21.04,39.7 25.2,39.7 ; 19.93,40.81 19.22,40.1 16.8,40.1 15.11,41.79 15.11,43.5 C11.1 ; 19.93,40.81 20.55,41.44 20.55,41.82 20.3,42.08 C13.1 ; U2.6 38.52,54.7 38.13,55.09 37.81,55.09 36.7,56.2 36.7,57.86 37.28,58.43 38.42,58.43 39.25,57.6 ; U2.2 37.86,49.42 37.86,50.33 38.33,50.8 38.33,51.02 38.47,51.16 38.47,53.74
  Top Layer w1: 29.3,59.41 26.82,56.92 C10.1 ; U19.18 49.5,27.05 U15.6 ; R3.1 42.47,57.6 44.05,56.02 44.05,55.81 44.1,55.76 44.1,55.6 C4.1 ; U19.3 4.3,26.65 U14.1
  Bottom Layer w0.254: v1(6.8,48.5) v1(10,48.5) ; U19.8 19.17,22.12 9.7,22.12 8.52,23.3 U19.3 ; U18.3 44.88,2.3 43.7,1.12 42.72,1.12 42.03,1.81 42.03,2.12 41.85,2.3 41.85,2.79 41.16,3.48 35.1,3.48 33.92,2.3 U18.8
1D1: length 49.2
  Bottom Layer w0.254: U19.19 45.89,20.9 28.5,20.9 26.61,22.79 26.61,23.79 23.7,26.7 7.19,26.7 U14.2
1D2: length 58.9
  Bottom Layer w0.254: U19.20 49.96,23.3 48.78,22.12 47.61,22.12 46.04,20.54 10.26,20.54 8.68,22.12 7.16,22.12 6.47,22.81 6.47,24.33 4.93,25.87 3.28,25.87 3.12,26.03 3.12,27.68 2.7,28.1 2.7,29.66 4.3,31.26 U14.3
2D1: length 59.9
  Top Layer w0.254: U18.1 48.96,0.43 37.67,0.43 36.95,1.15 36.95,2.95 37.91,3.91 38.61,3.91 49.5,14.8 49.5,26.02 50.68,27.2 50.68,33.52 49.99,34.21 49.5,34.21 49.32,34.39 49.01,34.39 48.32,35.08 48.32,36.06 49.5,37.24 U15.2
2D2: length 35.8
  Top Layer w0.254: v1(52,15.9) 52.01,15.91 52.01,32.69 49.5,35.2 U15.3
  Bottom Layer w0.254: v1(52,15.9) 52,6.01 U18.2
AIN1: length 26.6
  Top Layer w0.254: v1(21.8,42.4) 23.1,42.4 23.42,42.07
  Bottom Layer w0.254: v1(21.8,42.4) 21.8,37.09 U19.14
AIN2: length 26.4
  Top Layer w0.254: v1(22.6,40.9) 23.22,40.9 23.24,40.92 23.61,40.92 23.88,41.19 23.88,41.87 24.08,42.07
  Bottom Layer w0.254: U19.15 37.83,23.6 37.83,24.14 22.6,39.37 v1(22.6,40.9)
AO1: length 25.2
  Top Layer w0.5: 24.08,36.33 24.08,34.4
  Top Layer w1: 24.08,34.4 21.29,31.62 9.89,31.62 U14.5
AO2: length 26.4
  Top Layer w0.5: 25.38,36.33 25.38,34.45 arc(25.23,34.21) 25.17,33.94 24.92,33.68
  Top Layer w1: 24.92,33.68 21.75,30.51 8.46,30.51 U14.4
BI: length 66.5
  Top Layer w0.254: v1(3.4,44.1) 4.19,44.1 SW1.1
  Bottom Layer w0.254: v1(3.4,44.1) 3.4,40.52 3.12,40.24 3.12,38.2 1.03,36.12 1.03,19.46 15.7,4.79 28.02,4.79 U18.9
BIN1: length 24
  Top Layer w0.254: v1(28.7,41.3) 27.98,42.03 27.98,42.07
  Bottom Layer w0.254: U19.16 28.7,35.27 v1(28.7,41.3)
BIN2: length 27.3
  Top Layer w0.254: 27.33,42.07 v1(27.33,42.8)
  Bottom Layer w0.254: U19.17 43.21,27.52 29.34,41.39 29.34,41.63 28.17,42.8 v1(27.33,42.8)
BO1: length 25.4
  Top Layer w0.5: 27.33,36.33 27.33,34.7
  Top Layer w1: U15.4 48.39,31.92 30.11,31.92 27.33,34.7
BO2: length 27.3
  Top Layer w0.5: 26.02,36.33 26.02,33.9
  Top Layer w1: 26.02,33.9 29.44,30.49 U15.5
ECHO: length 70
  Top Layer w0.254: H2.3 50.2,61.93 52.37,61.93 54.5,59.8 54.5,16.13 U18.5
SCL: length 44.3
  Top Layer w0.254: H1.2 5.18,60.1 4.06,61.23 2.12,61.23 1.42,60.53 1.42,46.62 0.7,45.9 0.7,27.71 U19.2
SDA: length 40.2
  Bottom Layer w0.254: H1.3 5.9,57.83 5.9,39.5 4.79,38.39 3.81,38.39 1.7,36.28 1.7,26.6 U19.1
TRIG: length 73.1
  Top Layer w0.254: H2.2 48.33,62.6 52.6,62.6 55.1,60.1 55.1,15.1 43.21,3.21 U18.4
VREF: length 8.6
  Top Layer w0.254: 26.67,42.07 26.5,41.9 26.5,41.88 26.48,41.85 26.48,41.19 26.21,40.92 25.19,40.92 24.92,41.19 24.92,41.87 24.73,42.07 24.73,42.83 23.66,43.9 23.3,43.9 21.7,45.5
$1N633: length 39.1
  Top Layer w0.254: 37.45,43.21 Q1.2 Q1.5 Q1.6 34.6,42.4 33.64,42.4 33.57,42.32 32.43,42.32 32.36,42.4 31.4,42.4 26.46,47.34 26.46,48.59 26.22,48.83 26.22,49.39 25.16,50.44 22.66,50.44 21.36,51.75 21.36,52.44 20.8,53 D1.1 ; 37.45,43.21 38.28,44.03 38.28,45.12 37.7,45.7 37.7,48.23 37.23,48.71 U2.1 ; 37.45,43.21 37.23,42.98 37.23,42.78 Q1.1 40.5,42.55 L1.1
  vias: v1(21.68,51.41)
$1N828: length 11.7
  Top Layer w0.254: C8.1 34.67,52.01 R4.1 34.4,54.4 v1(33.3,55.5) ; v1(38.1,55.8) 39.17,54.72 U2.5
  Bottom Layer w0.254: v1(38.1,55.8) 33.6,55.8 v1(33.3,55.5)
$1N1411: length 33.5
  Top Layer w0.254: v1(27.6,45.2) 26.5,45.2 R5.1 26.1,48.44 C9.1 ; v1(38.8,43.4) 39.17,43.78 U2.4 39.98,50.2 39.98,56.17 39.28,56.87 38.85,56.87 38.67,57.05 38.67,57.25 38.62,57.3 38.62,57.52 38.55,57.6 R3.2
  Bottom Layer w0.254: v1(38.8,43.4) 29.9,43.4 28.1,45.2 v1(27.6,45.2)
$1N2115: length 31.6
  Top Layer w0.5: Q1.4 34.7,44.4 C1.2 33,49.25 34.97,51.23 35.12,51.23 35.35,51.46 35.35,51.61 C8.2 35.64,52.22 U2.8 36.63,54.4 R4.2
  Top Layer w1: 35.9,54.4 35.9,55.7 31.7,59.9 31.7,60.72 30.82,61.6 28.72,61.6 27.22,60.1 24.7,60.1 U1.2
$1N2335: length 10.1
  Top Layer w0.254: U2.7 37.88,51.25 36.76,50.13 36.76,45.34 37.45,44.65 Q1.3
$1N3468: length 3.5
  Top Layer w0.5: U6.1 5,2.41 U18.19

## Text on the board
Bottom Silkscreen Layer: EHS Scioly / Diamond / Robot Tour 25
Top Silkscreen Layer: EHS Scioly / Diamond / Robot Tour 25 | By: Nachu T | Pico-Up
